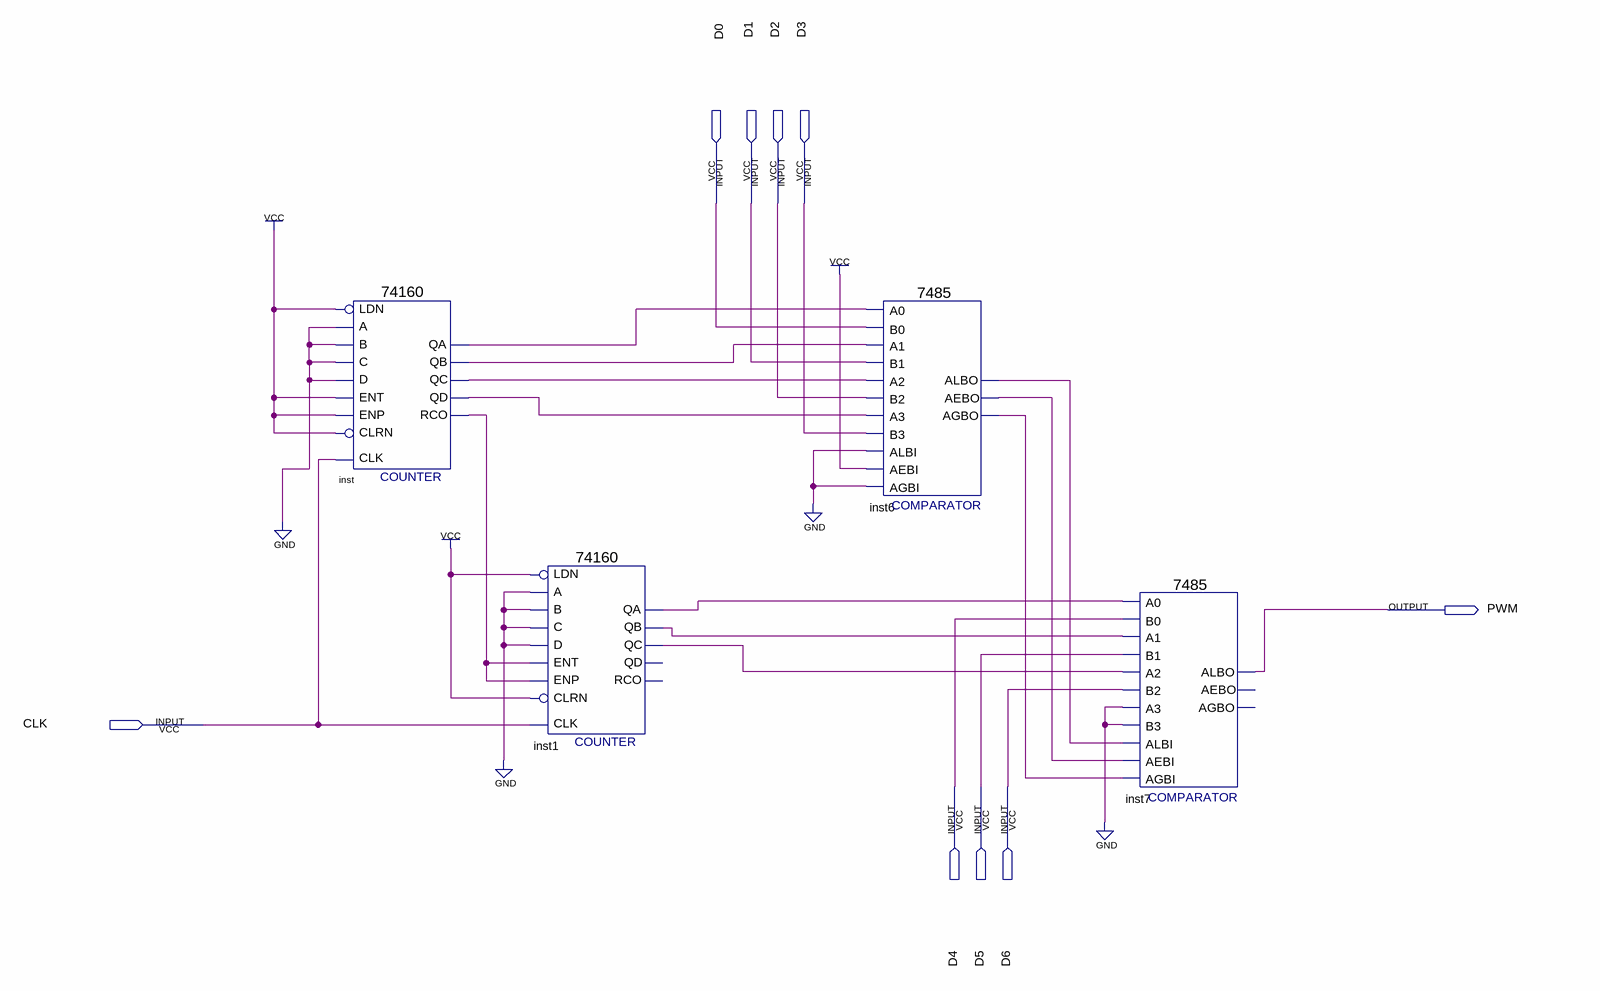
[diagram p0: schematic sheet]
// Quartus schematic PWMSchematic.bdf as structural Verilog: 4 symbols, 9 pins
module PWMSchematic (
  input  D0,
  input  D1,
  input  D2,
  input  D3,
  input  CLK,
  input  D4,
  input  D5,
  input  D6,
  output PWM
);

  wire inst1_qa, inst1_qb, inst1_qc, inst6_aebo, inst6_agbo, inst6_albo, inst_qa, inst_qb, inst_qc, inst_qd,
       inst_rco;

  \74160  inst (
    .CLK(CLK), .ENT(1'b1), .A(1'b0), .B(1'b0), .C(1'b0), .D(1'b0), .LDN(1'b1), .ENP(1'b1), .CLRN(1'b1),
    .QD(inst_qd), .QA(inst_qa), .QB(inst_qb), .QC(inst_qc), .RCO(inst_rco));
  \74160  inst1 (
    .CLK(CLK), .ENT(inst_rco), .A(1'b0), .B(1'b0), .C(1'b0), .D(1'b0), .LDN(1'b1), .ENP(inst_rco),
    .CLRN(1'b1), .QA(inst1_qa), .QB(inst1_qb), .QC(inst1_qc));  // open: QD, RCO
  \7485  inst6 (
    .A3(inst_qd), .B2(D2), .A2(inst_qc), .AEBI(1'b1), .AGBI(1'b0), .ALBI(1'b0), .A0(inst_qa), .B0(D0),
    .B3(D3), .A1(inst_qb), .B1(D1), .ALBO(inst6_albo), .AGBO(inst6_agbo), .AEBO(inst6_aebo));
  \7485  inst7 (
    .A3(1'b0), .B2(D6), .A2(inst1_qc), .AEBI(inst6_aebo), .AGBI(inst6_agbo), .ALBI(inst6_albo),
    .A0(inst1_qa), .B0(D4), .B3(1'b0), .A1(inst1_qb), .B1(D5), .ALBO(PWM));  // open: AGBO, AEBO
endmodule
